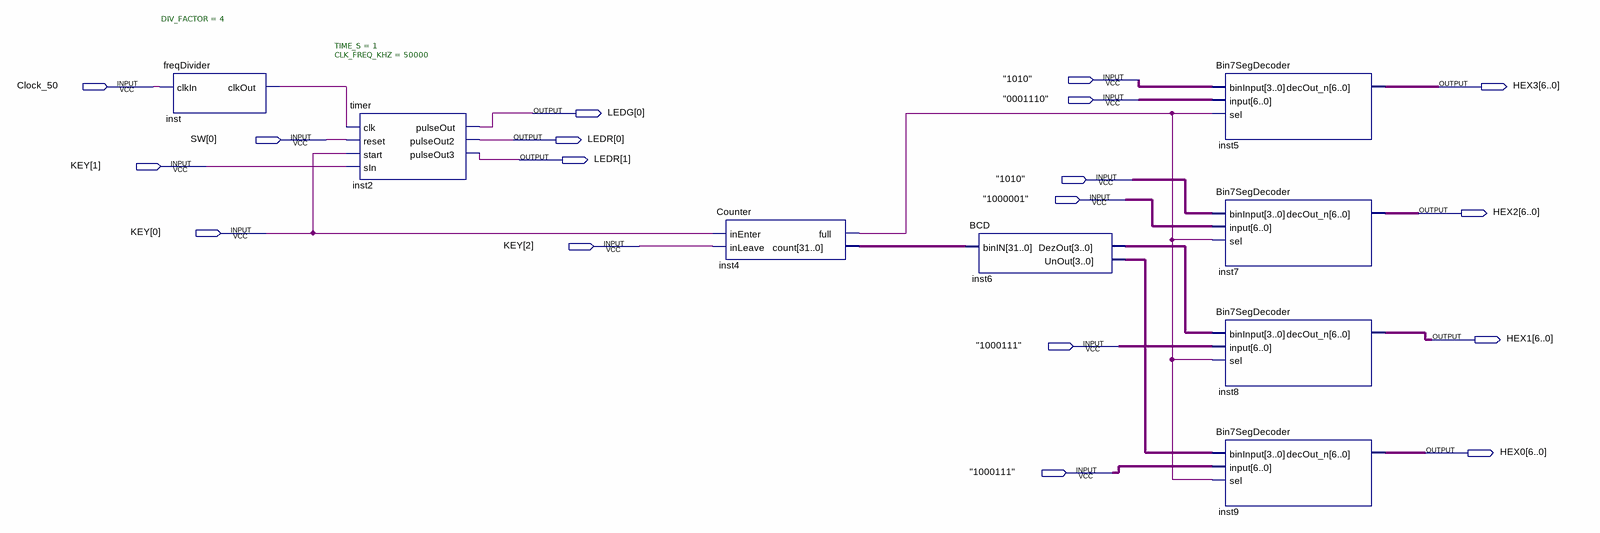
[diagram p0: schematic sheet]
// Quartus schematic fase4.bdf as structural Verilog: 8 symbols, 18 pins
module fase4 (
  input  \"1010" ,
  input  Clock_50,
  input  \"0001110" ,
  input  [0:0] SW,
  input  [2:0] KEY,
  input  \"1000001" ,
  input  \"1000111" ,
  output [6:0] HEX3,
  output [0:0] LEDG,
  output [1:0] LEDR,
  output [6:0] HEX2,
  output [6:0] HEX1,
  output [6:0] HEX0
);

  wire inst4_full, inst_clkout;
  wire [3:0] inst6_dezout, inst6_unout, undriven, undriven_2;
  wire [6:0] undriven_3, undriven_4, undriven_5, undriven_6;
  wire [31:0] inst4_count;

  freqDivider #(.DIV_FACTOR(4)) inst (.clkIn(Clock_50), .clkOut(inst_clkout));
  timer #(.TIME_S(1), .CLK_FREQ_KHZ(50000)) inst2 (
    .clk(inst_clkout), .reset(SW[0]), .start(KEY[0]), .sIn(KEY[1]), .pulseOut(LEDG[0]), .pulseOut2(LEDR[0]),
    .pulseOut3(LEDR[1]));
  Counter inst4 (.inEnter(KEY[0]), .inLeave(KEY[2]), .full(inst4_full), .count(inst4_count));
  BCD inst6 (.binIN(inst4_count), .DezOut(inst6_dezout), .UnOut(inst6_unout));
  Bin7SegDecoder inst5 (.binInput(undriven), .\input (undriven_4), .sel(inst4_full), .decOut_n(HEX3));
  Bin7SegDecoder inst7 (.binInput(undriven_2), .\input (undriven_3), .sel(inst4_full), .decOut_n(HEX2));
  Bin7SegDecoder inst8 (.binInput(inst6_dezout), .\input (undriven_5), .sel(inst4_full), .decOut_n(HEX1));
  Bin7SegDecoder inst9 (.binInput(inst6_unout), .\input (undriven_6), .sel(inst4_full), .decOut_n(HEX0));
endmodule
